# EAGLE schematic AVR_ISP (EAGLE 4.16)

## Sheet 1 of 2
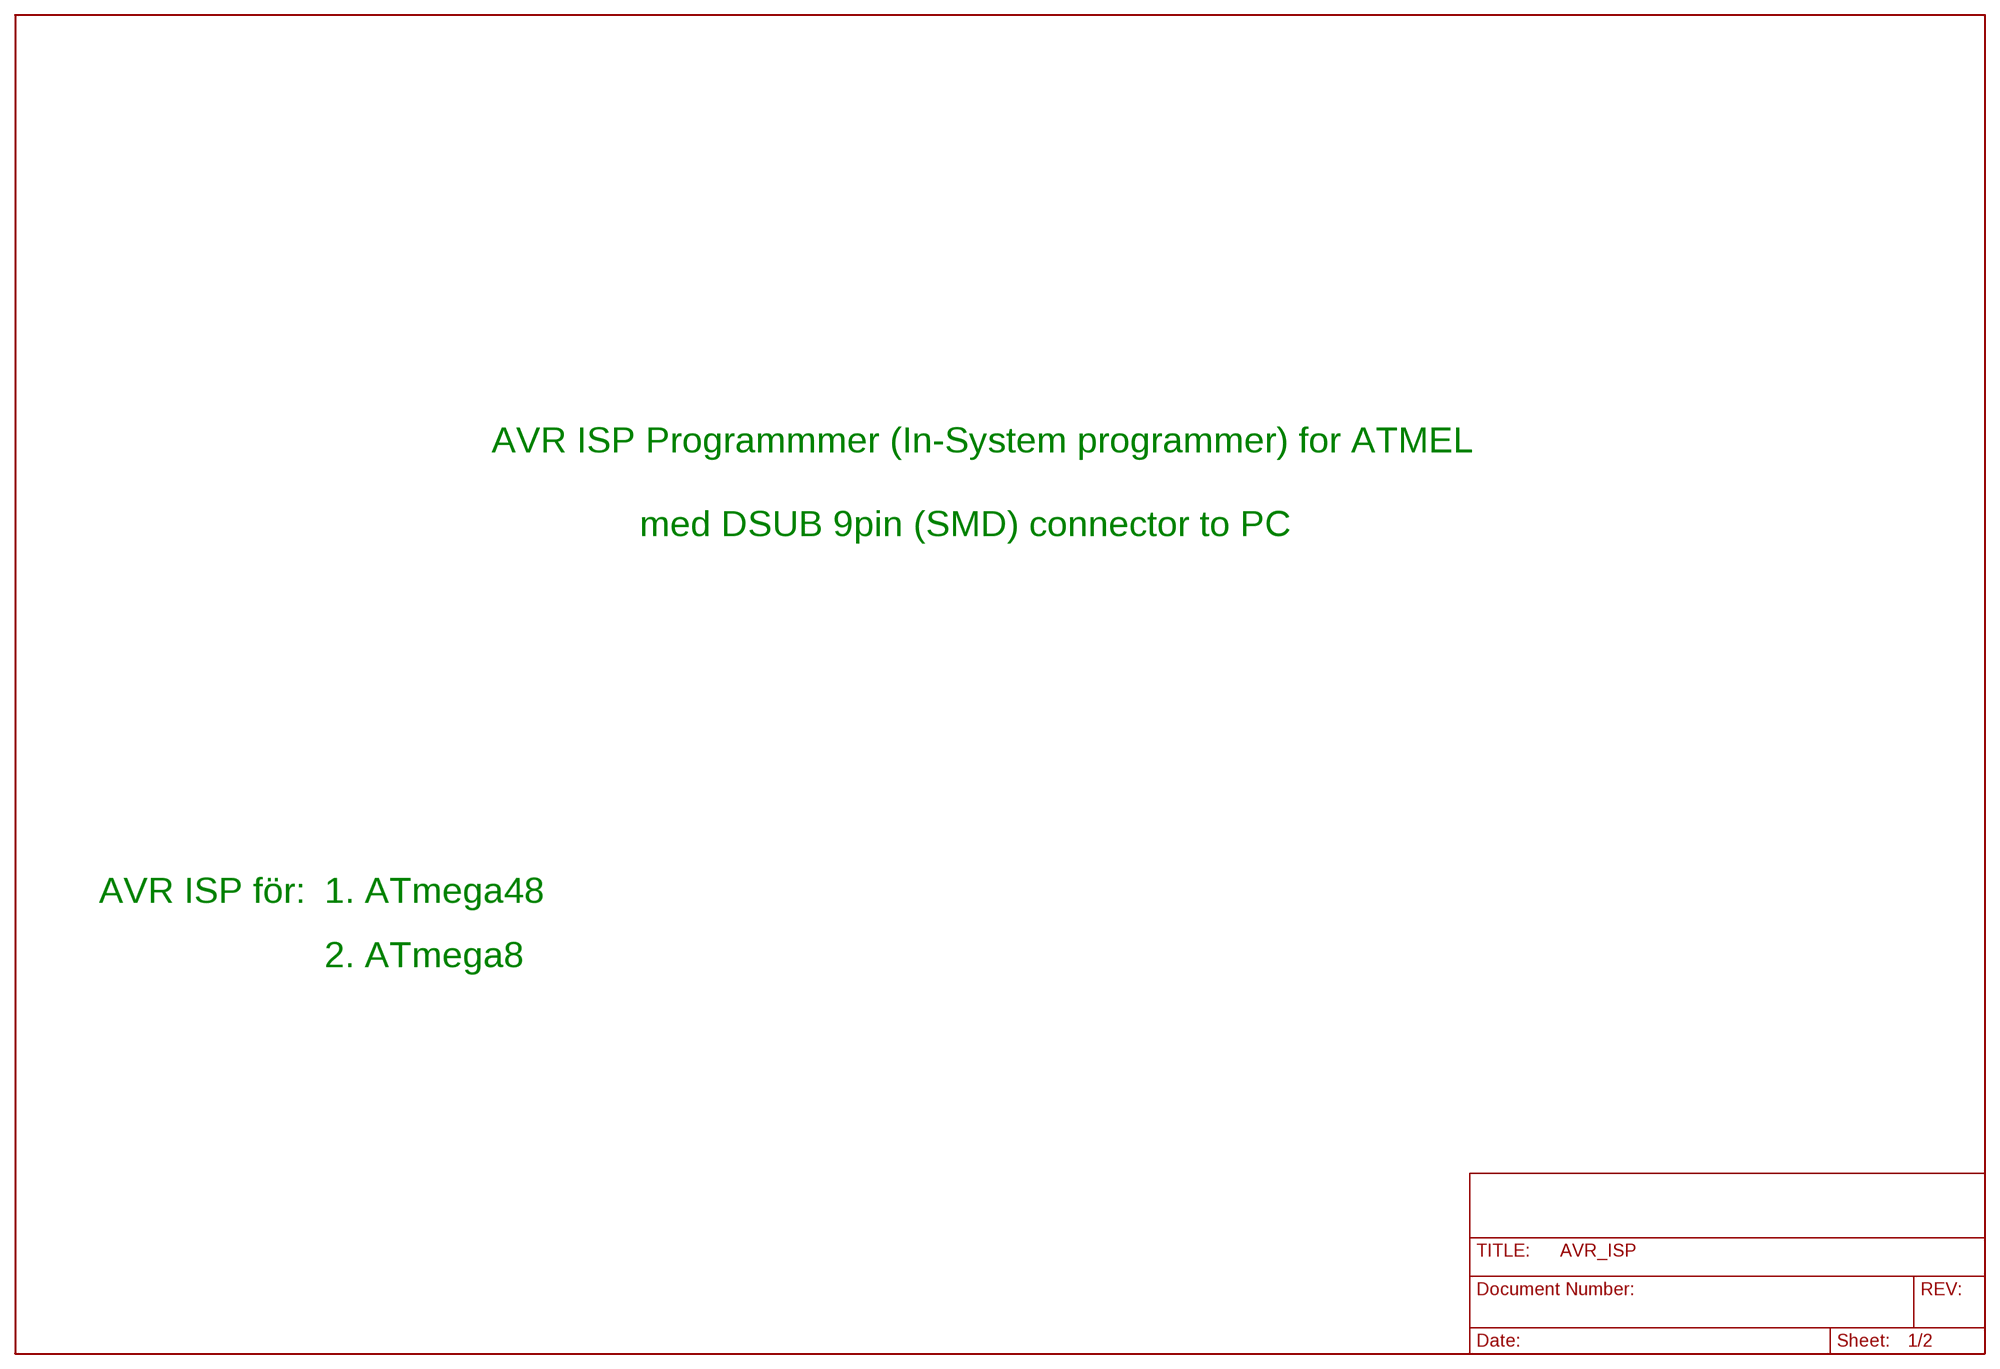
[diagram p0: schematic, sheet 1]

### Notes on the sheet
- AVR ISP Programmmer (In-System programmer) for ATMEL
- AVR ISP Programer (In-System-Programmer) | med DSUB 9pin (SMD) connector to PC
- for Atmel AVR Microcontrollers
- AVR ISP för: | 1. ATmega48
- 2. ATmega8

## Sheet 2 of 2
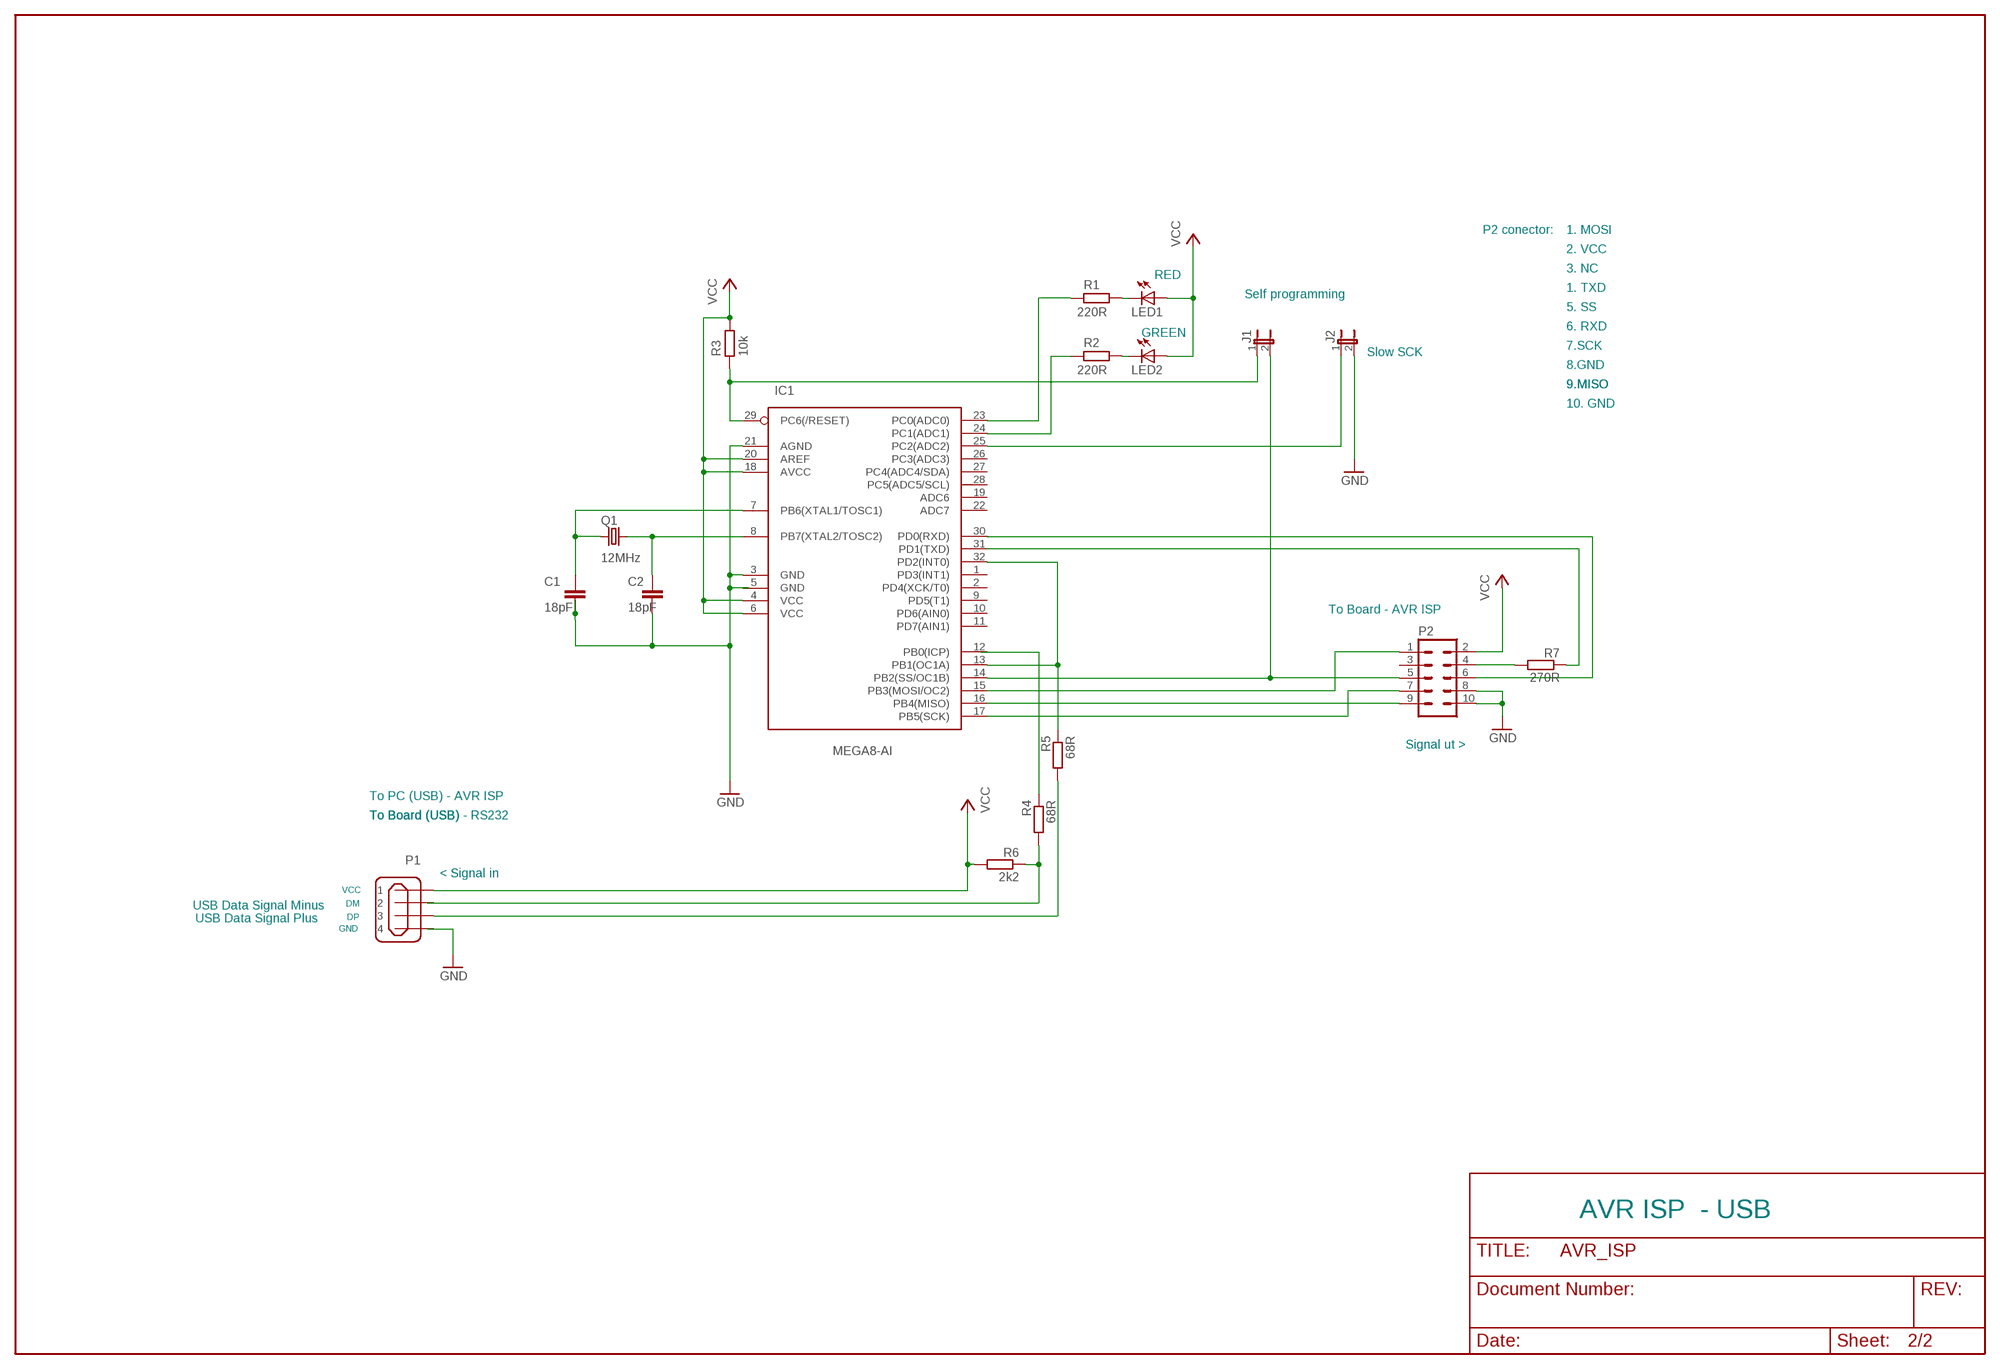
[diagram p1: schematic, sheet 2]

### Parts
C1  18pF  C-EUC0805K  [C0805K]
C2  18pF  C-EUC0805K  [C0805K]
IC1  MEGA8-AI  [TQFP32-08]
J1  JP1E  [JP1]
J2  JP1E  [JP1]
LED1  LED3MM  [LED3MM]
LED2  LED3MM  [LED3MM]
P1  USB_4POL_PCB_FEMALE  [USB_4POL_PCB_FEMALE]
P2  AMP_L_90_10P  [AMP_L_90_10P]
Q1  12MHz  CRYSTALSM49  [SM49]
R1  220R  R-EU_M0805  [M0805]
R2  220R  R-EU_M0805  [M0805]
R3  10k  R-EU_M0805  [M0805]
R4  68R  R-EU_M0805  [M0805]
R5  68R  R-EU_M0805  [M0805]
R6  2k2  R-EU_M0805  [M0805]
R7  270R  R-EU_M0805  [M0805]

### Nets
0V: IC1.23(PC0(ADC0)) R1.1
+5V: IC1.4(VCC) IC1.6(VCC) IC1.18(AVCC) IC1.20(AREF) P2.2 R3.2 ; supply symbol labelled VCC
GND: C1.2 C2.2 IC1.3(GND) IC1.5(GND) IC1.21(AGND) J2.2 P1.4 P2.8 P2.10
N$4: C2.1 IC1.8(PB7(XTAL2/TOSC2)) Q1.2
N$10: P1.2 R4.2 R6.1
N$12: P1.3 R5.2
N$22: LED1.K(C) R1.2
N$47: C1.1 IC1.7(PB6(XTAL1/TOSC1)) Q1.1
N$48: LED2.K(C) R2.2
N$53: P2.4 R7.2
N$54: IC1.31(PD1(TXD)) R7.1
N$55: IC1.30(PD0(RXD)) P2.6
N$56: IC1.15(PB3(MOSI/OC2)) P2.1
N$57: IC1.17(PB5(SCK)) P2.7
N$58: IC1.14(PB2(SS/OC1B)) J1.2 P2.5
N$59: IC1.29(PC6(/RESET)) J1.1 R3.1
N$60: IC1.25(PC2(ADC2)) J2.1
N$61: IC1.12(PB0(ICP)) R4.1
N$62: IC1.24(PC1(ADC1)) R2.1
N$63: IC1.13(PB1(OC1A)) IC1.32(PD2(INT0)) R5.1
N$67: IC1.16(PB4(MISO)) P2.9
VCC: P1.1 R6.2
VCCINT: LED1.A LED2.A ; supply symbol labelled VCC
Unconnected: IC1.1(PD3(INT1)) IC1.2(PD4(XCK/T0)) IC1.9(PD5(T1)) IC1.10(PD6(AIN0)) IC1.11(PD7(AIN1)) IC1.19(ADC6) IC1.22(ADC7) IC1.26(PC3(ADC3)) IC1.27(PC4(ADC4/SDA)) IC1.28(PC5(ADC5/SCL)) P2.3

### Notes on the sheet
- P2 conector: | 1. MOSI
- 2. VCC
- 3. NC
- RED
- 1. TXD
- Self programming
- 5. SS
- 6. RXD
- GREEN
- 7.SCK
- Slow SCK
- 8.GND
- 9.MISO | 9.MISO
- 10. GND
- To Board - AVR ISP
- Signal ut >
- To PC (USB) - AVR ISP
- To Board (USB) | To Board (USB) - RS232
- < Signal in
- VCC
- DM
- USB Data Signal Minus
- USB Data Signal Plus | DP
- GND
- AVR ISP  - USB

## Library data of the parts
C1 C2 = rcl:C-EU: CAPACITOR, European symbol
IC1 = atmel:MEGA8: MICROCONTROLLER 8 Kbytes FLASH 1 kbytes SRAM 512 bytes EEPROM USART 6-channel 10 bit ADC 2-channel 8 bit ADC Source: avr.lbr
J1 J2 = jumper:JP1E: JUMPER
LED1 LED2 = led:LED: LED OSRAM: - CHIPLED LG R971, LG N971, LY N971, LG Q971, LY Q971, LO R971, LY R971 LH N974, LH R974 LS Q976, LO Q976, LY Q976 LO Q996 - Hyper CHIPLED LW Q18S LB Q993, LB Q99A, LB R99A - SideLED LS A670, LO A670, LY A670, LG A670, LP A670 LB A673, LV A673, LT A673, LW A673 LH A674 LY A675 LS A676, LA A676, LO A676, LY A676, LW A676 LS A679, LY A679, LG A679 - Hyper Micro SIDELED® LS Y876, LA Y876, LO Y876, LY Y876 LT Y87S - SmartLED LW L88C, LW L88S LB L89C, LB L89S, LG L890 LS L89K, LO L89K, LY L89K LS L896, LA L896, LO L896, LY L896 - TOPLED LS T670, LO T670, LY T670, LG T670, LP T670 LSG T670, LSP T670, LSY T670, LOP T670, LYG T670 LG T671, LOG T671, LSG T671 LB T673, LV T673, LT T673, LW T673 LH T674 LS T676, LA T676, LO T676, LY T676, LB T676, LH T676, LSB T676, LW T676 LB T67C, LV T67C, LT T67C, LS T67K, LO T67K, LY T67K, LW E67C LS E67B, LA E67B, LO E67B, LY E67B, LB E67C, LV E67C, LT E67C LW T67C LS T679, LY T679, LG T679 LS T770, LO T770, LY T770, LG T770, LP T770 LB T773, LV T773, LT T773, LW T773 LH T774 LS E675, LA E675, LY E675, LS T675 LS T776, LA T776, LO T776, LY T776, LB T776 LHGB T686 LT T68C, LB T68C - Hyper Mini TOPLED® LB M676 - Mini TOPLED Santana® LG M470 LS M47K, LO M47K, LY M47K Source: http://www.osram.convergy.de/
P1 = sc-librari:USB_4POL_PCB_FEMALE
P2 = sc-librari:AMP_L_90_10P
Q1 = crystal:CRYSTAL: CRYSTAL
R1-R7 = rcl:R-EU_: RESISTOR, European symbol